# Altium schematic sheet Fleet-Monitor-CAN.SchDoc: Fleet Monitor
size A4; Subtitle: CAN Isolator; DocumentNumber: 4; Revision: V1.0; SheetNumber: 4; SheetTotal: 8; Author: Florian Baumgartner & Luca Jost
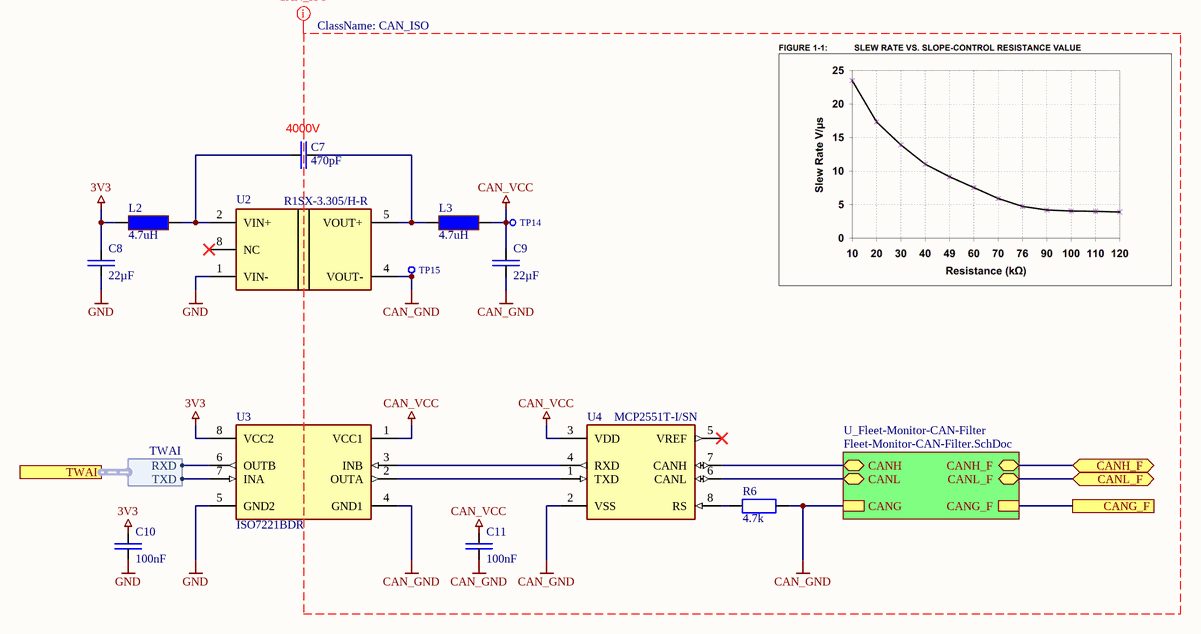
[diagram p0: Fleet-Monitor-CAN.SchDoc]

## Parts
C7  470pF  [SMD Keramikkondensator 1808]
C8  22µF  [SMD Keramikkondensator 0603]
C9  22µF  [SMD Keramikkondensator 0603]
C10  100nF  [SMD Keramikkondensator 0603]
C11  100nF  [SMD Keramikkondensator 0603]
L2  4.7uH  [SMD INDUCTOR/FERRITE 0805]
L3  4.7uH  [SMD INDUCTOR/FERRITE 0805]
R6  4.7k  [SMD Widerstand 0603]
TP14  X-TP  [SMD Testpunkt Ø1mm]  (value not drawn)  (no BOM)
TP15  X-TP  [SMD Testpunkt Ø1mm]  (value not drawn)  (no BOM)
U2  R1SX-3.305/H-R  [SMD DCDC R1SX]
U3  ISO7221BDR  [SMD IC SOIC-8]
U4  MCP2551T-I/SN  [SMD IC SOIC-8]

## Sub-sheets
U_Fleet-Monitor-CAN-Filter = Fleet-Monitor-CAN-Filter.SchDoc: CANH (bidir), CANL (bidir), CANG, CANH_F (bidir), CANL_F (bidir), CANG_F

## Ports
CANG_F, CANH_F (bidir), CANL_F (bidir), TWAI (harness TWAI)

## Harnesses
TWAI: TXD, RXD

## Nets
3V3: C8.2 C10.2 L2.1 U3.8(VCC2)
CAN_GND: C9.1 C11.1 R6.2 TP15.1 U2.4(VOUT-) U3.4(GND1) U4.2(VSS) ; sheet U_Fleet-Monitor-CAN-Filter/CANG
CAN_VCC: C9.2 C11.2 L3.2 TP14.1 U3.1(VCC1) U4.3(VDD)
GND: C8.1 C10.1 U2.1(VIN-) U3.5(GND2)
CANG_F: port CANG_F, sheet U_Fleet-Monitor-CAN-Filter/CANG_F
CANH_F: port CANH_F, sheet U_Fleet-Monitor-CAN-Filter/CANH_F
CANL_F: port CANL_F, sheet U_Fleet-Monitor-CAN-Filter/CANL_F
NetC7_1: C7.1 L2.2 U2.2(VIN+)
NetC7_2: C7.2 L3.1 U2.5(VOUT+)
NetR6_1: R6.1 U4.8(RS)
NetU3_2: U3.2(OUTA) U4.1(TXD)
NetU3_3: U3.3(INB) U4.4(RXD)
NetU3_6: U3.6(OUTB) ; port TWAI.RXD
NetU3_7: U3.7(INA) ; port TWAI.TXD
NetU4_6: U4.6(CANL) ; sheet U_Fleet-Monitor-CAN-Filter/CANL
NetU4_7: U4.7(CANH) ; sheet U_Fleet-Monitor-CAN-Filter/CANH

Not connected (* = marked no-connect by the designer): U2 8(NC)*; U4 5(VREF)*

## Layout directives
net class CAN_ISO: CAN_GND, CAN_VCC

## Notes on the sheet
- (near C7) 4000V
- Title
- Author:
- Subtitle
- Date:
- Rev:
- File:
- Sheet
- of

## Library data of the parts
C7 = E6 - 470pF: SMD Ceramic Capacitor E6; Component Value: 470pF 3kV; Component Description: Multilayer Ceramic Capacitors MLCC; ComponentLink1Description: Datasheet; ComponentLink1URL: https://datasheet.lcsc.com/lcsc/1810201242_IHHEC-HOLY-STONE-ENTERPRISE-CO.,-LTD-C1808X471K302T_C106130.pdf; Digikey: 732-12100-1-ND; Farnell: 2812607; JLC-Parts: C106130; Mouser: 710-885342210003; Unit Price: 0.11
C8 C9 = E6 - 22uF: SMD Ceramic Capacitor E6; Component Value: 22µF 25V; Component Description: Multilayer Ceramic Capacitors MLCC; ComponentLink1Description: Datasheet; ComponentLink1URL: https://datasheet.lcsc.com/lcsc/1811151152_Samsung-Electro-Mechanics-CL21A226MAQNNNE_C45783.pdf; Digikey: 1276-2908-1-ND; Farnell: 3013459; JLC-Parts: C45783; Mouser: 187-CL21A226MAQNNNE; Unit Price: 0.04
C10 C11 = E6 - 100nF: SMD Ceramic Capacitor E6; Component Value: 100nF 50V; Component Description: Multilayer Ceramic Capacitors MLCC; ComponentLink1Description: Datasheet; ComponentLink1URL: https://datasheet.lcsc.com/lcsc/1809301912_YAGEO-CC0603KRX7R9BB104_C14663.pdf; Digikey: 445-6899-1-ND; Farnell: 2210822; JLC-Parts: C14663; Mouser: 810-CGA2B3X7R1H104K; Unit Price: 0.01
L2 L3 = MLP2012V4R7MT0S1: 0805 Inductor 4.7uH; Component Description: Power Inductor; ComponentLink1Description: Datasheet; ComponentLink1URL: https://datasheet.lcsc.com/lcsc/1810241416_Murata-Electronics-LQM2MPN4R7MG0L_C86094.pdf; Component Value: 4.7uH; Digikey: 490-12073-1-ND; Farnell: 2840129; JLC-Parts: C86094; Mouser: 81-LQM2MPN4R7MG0L; Unit Price: 0.09
R6 = E24 - 4.7k: SMD Chip Resistor E24; Component Value: 4.7k (75V, 100mW, 1%); ComponentLink1Description: Datasheet; ComponentLink1URL: https://datasheet.lcsc.com/lcsc/1810200710_UNI-ROYAL-Uniroyal-Elec-0603WAF4701T5E_C23162.pdf; Digikey: P4.70KHCT-ND; Farnell: 2303181; JLC-Parts: C23162; Mouser: 667-ERJ-3EKF4701V; Unit Price: 0.01; Component Description: Chip Resistor
TP14 TP15 = X-TP: Testpunkt; Component Value: Ø 0.8mm; Component Description: Testpoint; Unit Price: 0.00
U2 = R1SX-3.305/H-R: Isolated Module DC DC Converter 1 Output 5V - - - 200mA 2.97V - 3.63V Input; Component Description: Isolated DC-DC-Converter; ComponentLink1Description: Datasheet; ComponentLink1URL: https://recom-power.com/pdf/Econoline/R1SX.pdf; Digikey: 945-3197-1-ND; Component Value: R1SX-3.305/H-R; Mouser: 919-R1SX-3.305/H-R; Unit Price: 3.94
U3 = ISO7221BDR: General Purpose Digital Isolator 2500Vrms 2 Channel 5Mbps 25kV/µs CMTI 8-SOIC (0.154", 3.90mm Width); Component Description: Unidirectional Digital Isolator; ComponentLink1Description: Datasheet; ComponentLink1URL: https://www.ti.com/lit/ds/symlink/iso7220a.pdf?HQS=dis-dk-null-digikeymode-dsf-pf-null-wwe&ts=1633476815997; Digikey: 296-38965-2-ND; Component Value: ISO7221BDR; JLC-Parts: C138522; Mouser: 595-ISO7221BDR; Unit Price: 2.94
U4 = MCP2551T-I/SN: High-Speed CAN Transceiver; Component Description: CAN Transceiver 1Mbps; Digikey: MCP2551T-I/SNTR-ND; ComponentLink1Description: Datasheet; ComponentLink1URL: https://ww1.microchip.com/downloads/en/DeviceDoc/20001667G.pdf; Component Value: MCP2551T-I/SN; Farnell: 2763381; JLC-Parts: C49558; Mouser: 579-MCP2551T-I/SN; Unit Price: 1.04